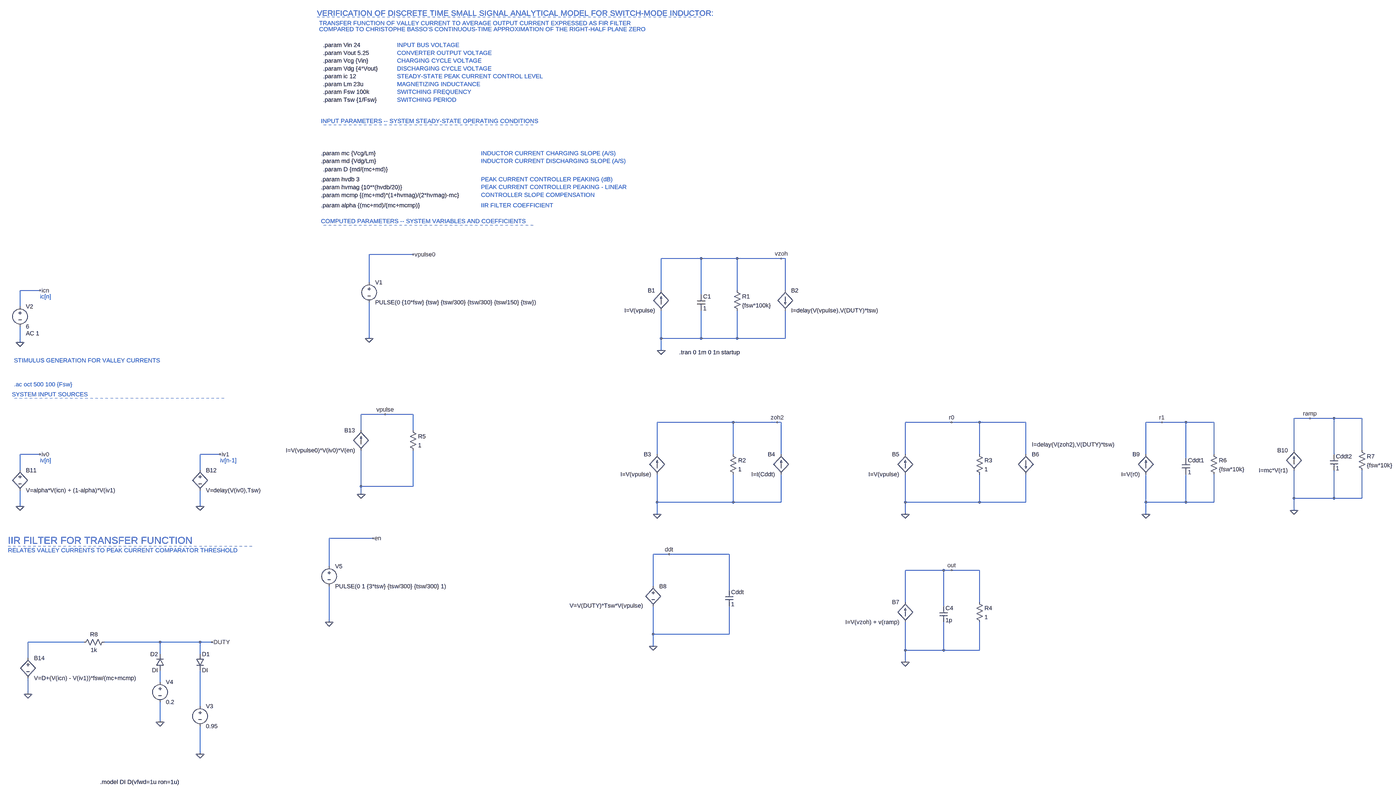
[diagram p0: schematic ZOH_time_domain.asc, whole sheet]
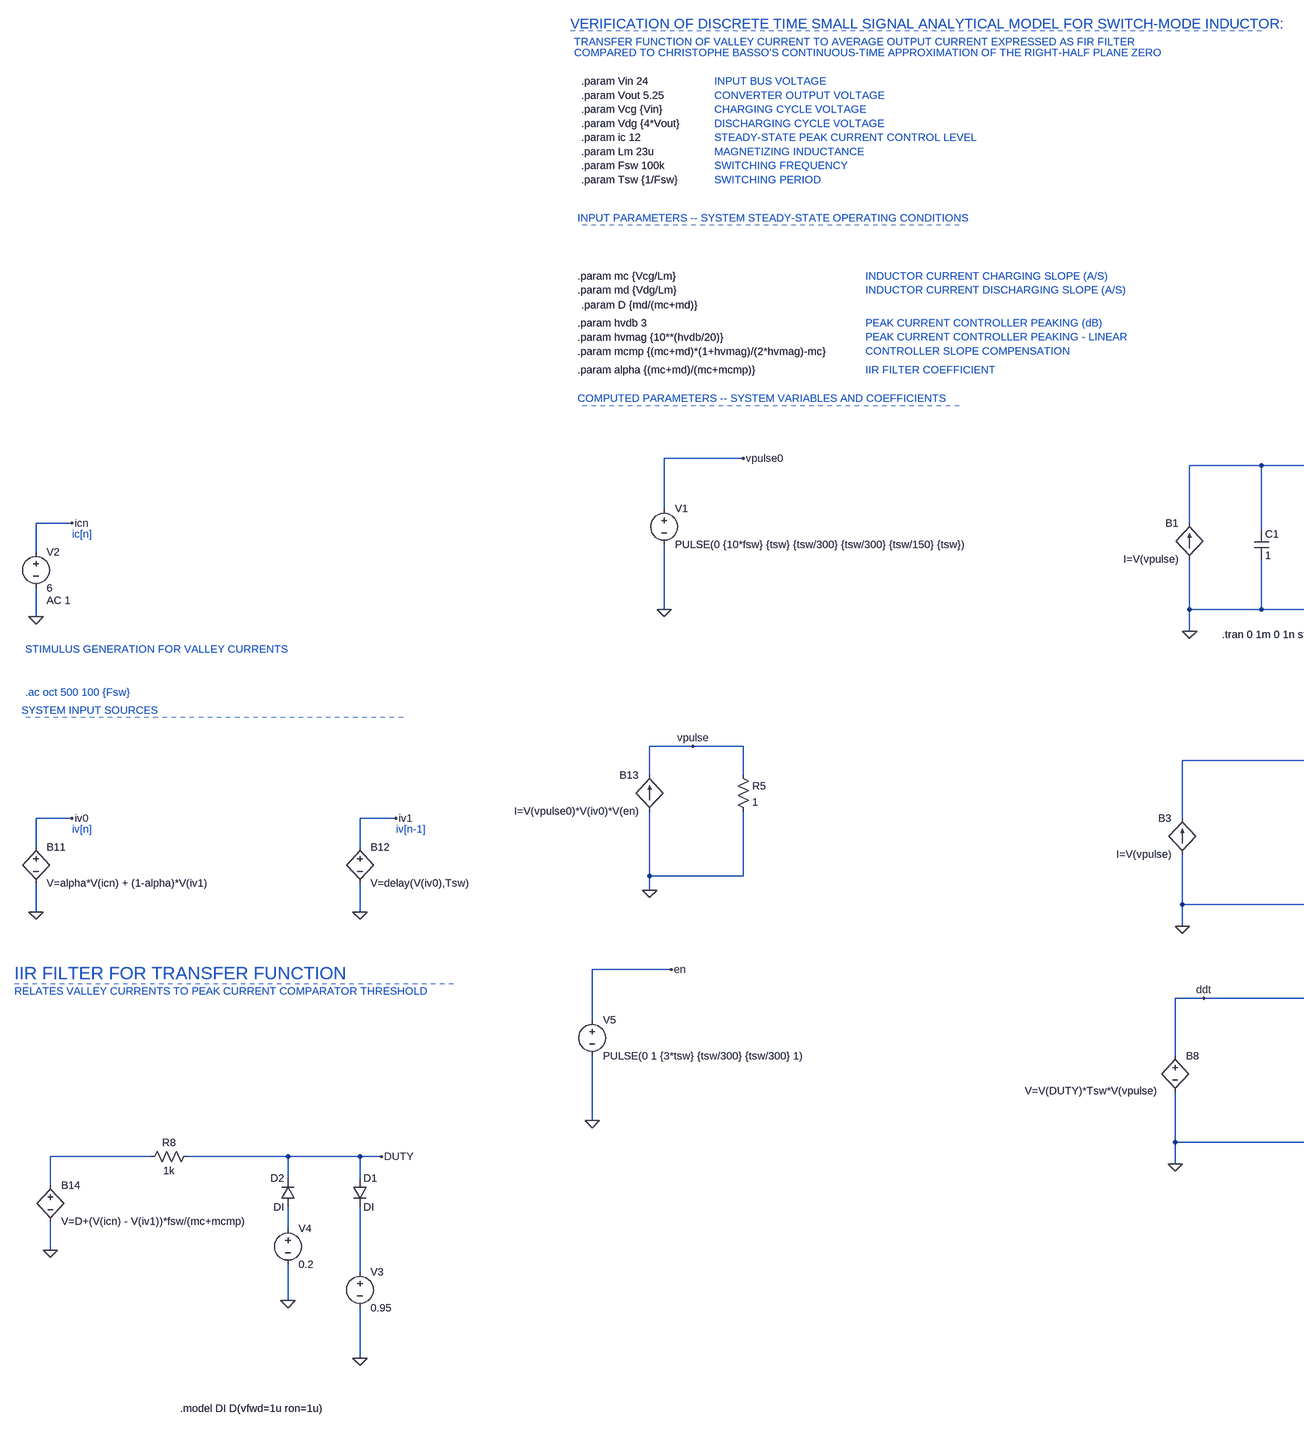
[diagram p1: schematic ZOH_time_domain.asc, part, row 1 of 1, column 1 of 2]
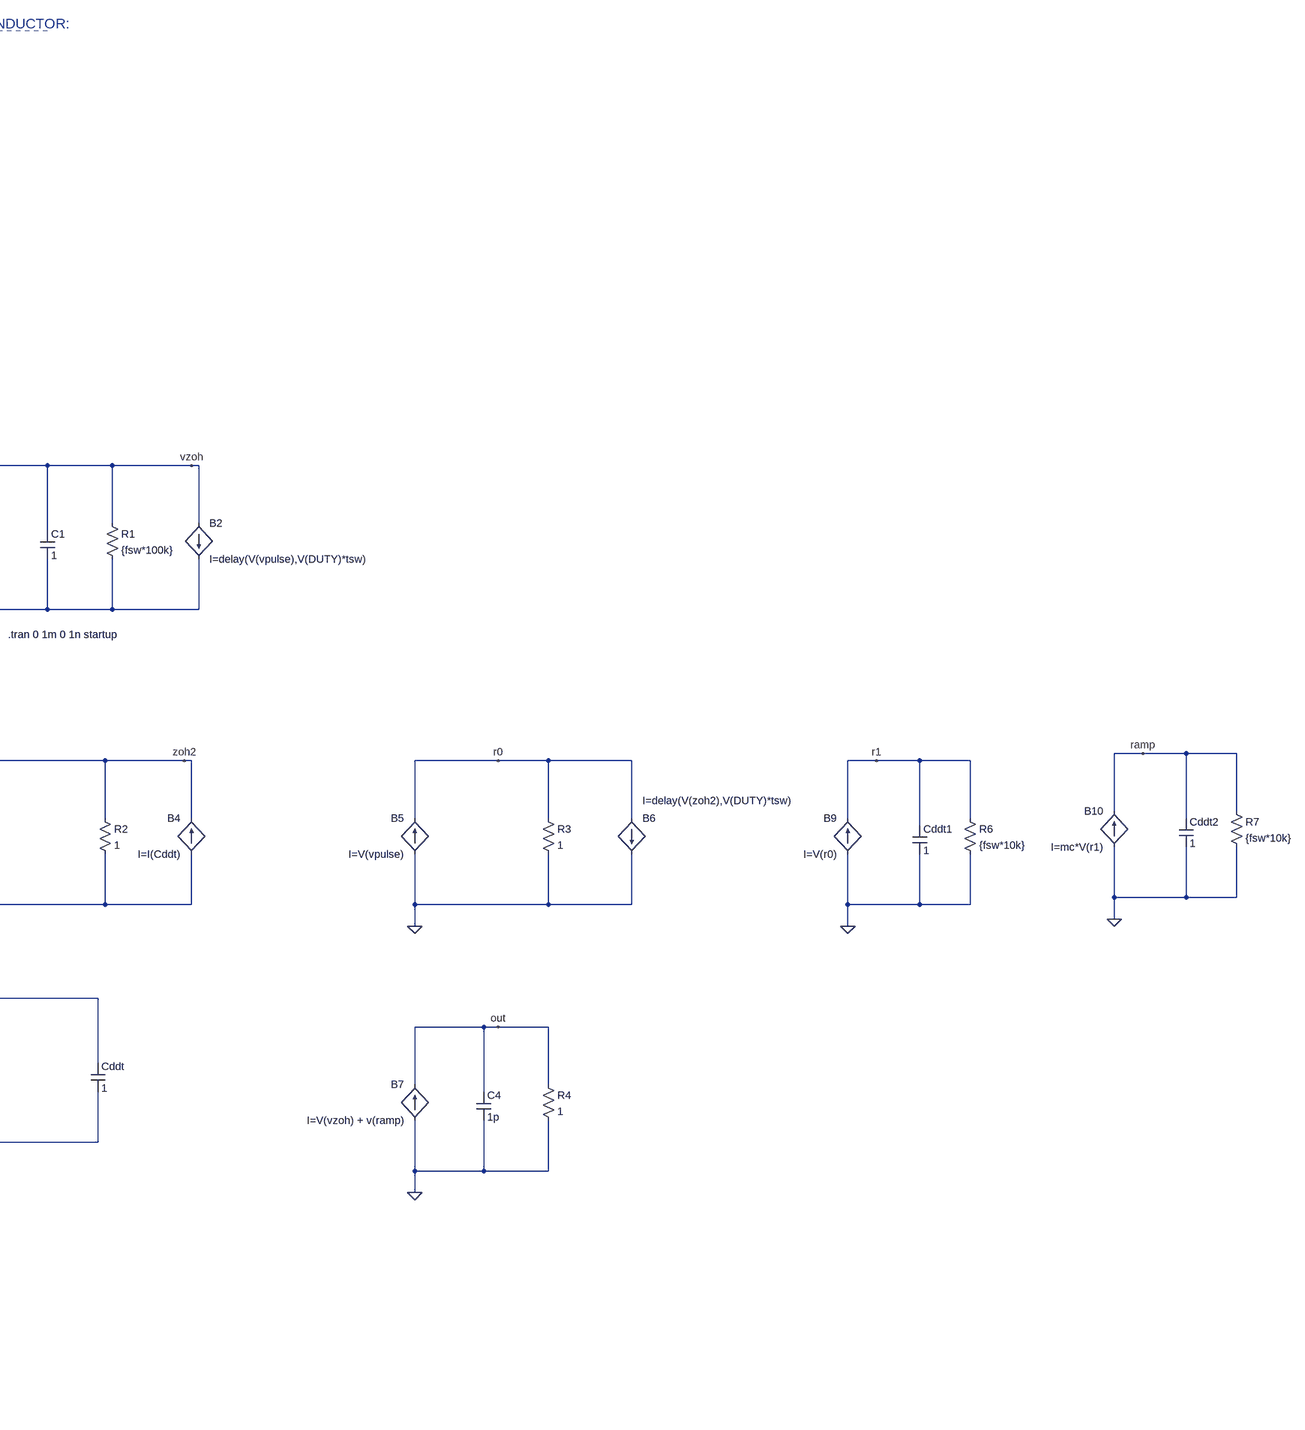
[diagram p2: schematic ZOH_time_domain.asc, part, row 1 of 1, column 2 of 2]
ZOH_time_domain.asc, the LTspice schematic file:
Version 4
SHEET 1 4228 4212
WIRE -848 208 -1024 208
WIRE 304 224 144 224
WIRE 448 224 304 224
WIRE 624 224 448 224
WIRE 640 224 624 224
WIRE -1024 320 -1024 208
WIRE -3120 352 -3200 352
WIRE 144 352 144 224
WIRE 448 352 448 224
WIRE 640 352 640 224
WIRE 304 368 304 224
WIRE -3200 416 -3200 352
WIRE -1024 544 -1024 400
WIRE 144 544 144 432
WIRE 304 544 304 432
WIRE 304 544 144 544
WIRE 448 544 448 432
WIRE 448 544 304 544
WIRE 640 544 640 432
WIRE 640 544 448 544
WIRE -3200 560 -3200 496
WIRE 144 592 144 544
WIRE -960 848 -1056 848
WIRE -848 848 -960 848
WIRE 2800 864 2736 864
WIRE 2896 864 2800 864
WIRE 3008 864 2896 864
WIRE 432 880 128 880
WIRE 608 880 432 880
WIRE 624 880 608 880
WIRE 1312 880 1120 880
WIRE 1424 880 1312 880
WIRE 1664 880 1424 880
WIRE 2208 880 2144 880
WIRE 2304 880 2208 880
WIRE 2416 880 2304 880
WIRE -1056 912 -1056 848
WIRE -848 912 -848 848
WIRE 2736 992 2736 864
WIRE 3008 992 3008 864
WIRE -3120 1008 -3200 1008
WIRE -2400 1008 -2480 1008
WIRE 128 1008 128 880
WIRE 432 1008 432 880
WIRE 624 1008 624 880
WIRE 1120 1008 1120 880
WIRE 1424 1008 1424 880
WIRE 1664 1008 1664 880
WIRE 2144 1008 2144 880
WIRE 2416 1008 2416 880
WIRE 2896 1008 2896 864
WIRE 2304 1024 2304 880
WIRE -3200 1072 -3200 1008
WIRE -2480 1072 -2480 1008
WIRE -1056 1136 -1056 992
WIRE -848 1136 -848 992
WIRE -848 1136 -1056 1136
WIRE -1056 1168 -1056 1136
WIRE 2736 1184 2736 1072
WIRE 2896 1184 2896 1072
WIRE 2896 1184 2736 1184
WIRE 3008 1184 3008 1072
WIRE 3008 1184 2896 1184
WIRE 128 1200 128 1088
WIRE 432 1200 432 1088
WIRE 432 1200 128 1200
WIRE 624 1200 624 1088
WIRE 624 1200 432 1200
WIRE 1120 1200 1120 1088
WIRE 1424 1200 1424 1088
WIRE 1424 1200 1120 1200
WIRE 1664 1200 1664 1088
WIRE 1664 1200 1424 1200
WIRE 2144 1200 2144 1088
WIRE 2304 1200 2304 1088
WIRE 2304 1200 2144 1200
WIRE 2416 1200 2416 1088
WIRE 2416 1200 2304 1200
WIRE -3200 1216 -3200 1152
WIRE -2480 1216 -2480 1152
WIRE 2736 1232 2736 1184
WIRE 128 1248 128 1200
WIRE 1120 1248 1120 1200
WIRE 2144 1248 2144 1200
WIRE -1008 1344 -1184 1344
WIRE 176 1408 112 1408
WIRE 416 1408 176 1408
WIRE -1184 1456 -1184 1344
WIRE 1280 1472 1120 1472
WIRE 1312 1472 1280 1472
WIRE 1424 1472 1312 1472
WIRE 112 1536 112 1408
WIRE 416 1552 416 1408
WIRE 1120 1600 1120 1472
WIRE 1424 1600 1424 1472
WIRE 1280 1616 1280 1472
WIRE -1184 1680 -1184 1536
WIRE 112 1728 112 1616
WIRE 416 1728 416 1616
WIRE 416 1728 112 1728
WIRE -2944 1760 -3168 1760
WIRE -2640 1760 -2864 1760
WIRE -2480 1760 -2640 1760
WIRE -2432 1760 -2480 1760
WIRE 112 1776 112 1728
WIRE 1120 1792 1120 1680
WIRE 1280 1792 1280 1680
WIRE 1280 1792 1120 1792
WIRE 1424 1792 1424 1680
WIRE 1424 1792 1280 1792
WIRE -2640 1808 -2640 1760
WIRE -2480 1808 -2480 1760
WIRE -3168 1824 -3168 1760
WIRE 1120 1840 1120 1792
WIRE -2640 1920 -2640 1872
WIRE -3168 1968 -3168 1904
WIRE -2480 2016 -2480 1872
WIRE -2640 2080 -2640 2000
WIRE -2480 2208 -2480 2096
FLAG -1024 544 0
FLAG -848 208 vpulse0
FLAG 144 592 0
FLAG 624 224 vzoh
FLAG 128 1248 0
FLAG 608 880 zoh2
FLAG 1120 1248 0
FLAG 1312 880 r0
FLAG 1120 1840 0
FLAG 1312 1472 out
FLAG 112 1776 0
FLAG 176 1408 ddt
FLAG 2144 1248 0
FLAG 2208 880 r1
FLAG 2736 1232 0
FLAG 2800 864 ramp
FLAG -3200 560 0
FLAG -3120 352 icn
FLAG -3200 1216 0
FLAG -3120 1008 iv0
FLAG -2480 1216 0
FLAG -2400 1008 iv1
FLAG -1056 1168 0
FLAG -960 848 vpulse
FLAG -3168 1968 0
FLAG -2432 1760 DUTY
FLAG -2640 2080 0
FLAG -2480 2208 0
FLAG -1184 1680 0
FLAG -1008 1344 en
SYMBOL voltage -1024 304 R0
WINDOW 123 0 0 Left 0
WINDOW 39 0 0 Left 0
SYMATTR InstName V1
SYMATTR Value PULSE(0 {10*fsw} {tsw} {tsw/300} {tsw/300} {tsw/150} {tsw})
SYMBOL bi 144 432 R180
WINDOW 0 24 80 Left 2
WINDOW 3 24 0 Left 2
SYMATTR InstName B1
SYMATTR Value I=V(vpulse)
SYMBOL res 432 336 R0
SYMATTR InstName R1
SYMATTR Value {fsw*100k}
SYMBOL bi 640 352 R0
SYMATTR InstName B2
SYMATTR Value I=delay(V(vpulse),V(DUTY)*tsw)
SYMBOL cap 288 368 R0
SYMATTR InstName C1
SYMATTR Value 1
SYMBOL bi 128 1088 R180
WINDOW 0 24 80 Left 2
WINDOW 3 24 0 Left 2
SYMATTR InstName B3
SYMATTR Value I=V(vpulse)
SYMBOL res 416 992 R0
SYMATTR InstName R2
SYMATTR Value 1
SYMBOL bi 624 1088 R180
WINDOW 0 24 80 Left 2
WINDOW 3 24 0 Left 2
SYMATTR InstName B4
SYMATTR Value I=I(Cddt)
SYMBOL bi 1120 1088 R180
WINDOW 0 24 80 Left 2
WINDOW 3 24 0 Left 2
SYMATTR InstName B5
SYMATTR Value I=V(vpulse)
SYMBOL res 1408 992 R0
SYMATTR InstName R3
SYMATTR Value 1
SYMBOL bi 1664 1008 R0
WINDOW 3 24 -39 Left 2
SYMATTR InstName B6
SYMATTR Value I=delay(V(zoh2),V(DUTY)*tsw)
SYMBOL bi 1120 1680 R180
WINDOW 0 24 80 Left 2
WINDOW 3 24 0 Left 2
SYMATTR InstName B7
SYMATTR Value I=V(vzoh) + v(ramp)
SYMBOL res 1408 1584 R0
SYMATTR InstName R4
SYMATTR Value 1
SYMBOL cap 1264 1616 R0
SYMATTR InstName C4
SYMATTR Value 1p
SYMBOL bi 2144 1088 R180
WINDOW 0 24 80 Left 2
WINDOW 3 24 0 Left 2
SYMATTR InstName B9
SYMATTR Value I=V(r0)
SYMBOL cap 2288 1024 R0
SYMATTR InstName Cddt1
SYMATTR Value 1
SYMBOL res 2400 992 R0
SYMATTR InstName R6
SYMATTR Value {fsw*10k}
SYMBOL bi 2736 1072 R180
WINDOW 0 24 80 Left 2
WINDOW 3 24 0 Left 2
SYMATTR InstName B10
SYMATTR Value I=mc*V(r1)
SYMBOL cap 2880 1008 R0
SYMATTR InstName Cddt2
SYMATTR Value 1
SYMBOL res 2992 976 R0
SYMATTR InstName R7
SYMATTR Value {fsw*10k}
SYMBOL cap 400 1552 R0
SYMATTR InstName Cddt
SYMATTR Value 1
SYMATTR SpiceLine Rser=100n
SYMBOL voltage -3200 400 R0
WINDOW 123 24 124 Left 2
WINDOW 39 0 0 Left 2
SYMATTR Value2 AC 1
SYMATTR InstName V2
SYMATTR Value 6
SYMBOL bv -3200 1056 R0
SYMATTR InstName B11
SYMATTR Value V=alpha*V(icn) + (1-alpha)*V(iv1)
SYMBOL bv -2480 1056 R0
SYMATTR InstName B12
SYMATTR Value V=delay(V(iv0),Tsw)
SYMBOL bi -1056 992 R180
WINDOW 0 24 80 Left 2
WINDOW 3 24 0 Left 2
SYMATTR InstName B13
SYMATTR Value I=V(vpulse0)*V(iv0)*V(en)
SYMBOL res -864 896 R0
SYMATTR InstName R5
SYMATTR Value 1
SYMBOL bv -3168 1808 R0
SYMATTR InstName B14
SYMATTR Value V=D+(V(icn) - V(iv1))*fsw/(mc+mcmp)
SYMBOL res -2848 1744 R90
WINDOW 0 0 56 VBottom 2
WINDOW 3 32 56 VTop 2
SYMATTR InstName R8
SYMATTR Value 1k
SYMBOL diode -2496 1808 R0
SYMATTR InstName D1
SYMATTR Value DI
SYMBOL diode -2624 1872 R180
WINDOW 0 24 64 Left 2
WINDOW 3 24 0 Left 2
SYMATTR InstName D2
SYMATTR Value DI
SYMBOL voltage -2480 2000 R0
WINDOW 123 0 0 Left 0
WINDOW 39 0 0 Left 0
SYMATTR InstName V3
SYMATTR Value 0.95
SYMBOL voltage -2640 1904 R0
WINDOW 123 0 0 Left 0
WINDOW 39 0 0 Left 0
SYMATTR InstName V4
SYMATTR Value 0.2
SYMBOL voltage -1184 1440 R0
WINDOW 123 0 0 Left 0
WINDOW 39 0 0 Left 0
SYMATTR InstName V5
SYMATTR Value PULSE(0 1 {3*tsw} {tsw/300} {tsw/300} 1)
SYMBOL bv 112 1520 R0
WINDOW 3 -334 94 Left 2
SYMATTR InstName B8
SYMATTR Value V=V(DUTY)*Tsw*V(vpulse)
TEXT -1208 -720 Left 2 !.param Vin 24\n.param Vout 5.25\n.param Vcg {Vin}\n.param Vdg {4*Vout}\n.param ic 12\n.param Lm 23u\n.param Fsw 100k\n.param Tsw {1/Fsw}
TEXT -1216 -272 Left 2 !.param mc {Vcg/Lm}\n.param md {Vdg/Lm}
TEXT -912 -720 Left 2 ;INPUT BUS VOLTAGE\nCONVERTER OUTPUT VOLTAGE\nCHARGING CYCLE VOLTAGE\nDISCHARGING CYCLE VOLTAGE\nSTEADY-STATE PEAK CURRENT CONTROL LEVEL\nMAGNETIZING INDUCTANCE\nSWITCHING FREQUENCY\nSWITCHING PERIOD
TEXT -1216 -416 Left 2 ;INPUT PARAMETERS -- SYSTEM STEADY-STATE OPERATING CONDITIONS
TEXT -576 -272 Left 2 ;INDUCTOR CURRENT CHARGING SLOPE (A/S)\nINDUCTOR CURRENT DISCHARGING SLOPE (A/S)
TEXT -1216 0 Left 2 ;COMPUTED PARAMETERS -- SYSTEM VARIABLES AND COEFFICIENTS
TEXT -1232 -848 Left 3 ;VERIFICATION OF DISCRETE TIME SMALL SIGNAL ANALYTICAL MODEL FOR SWITCH-MODE INDUCTOR:
TEXT -1224 -808 Left 2 ;TRANSFER FUNCTION OF VALLEY CURRENT TO AVERAGE OUTPUT CURRENT EXPRESSED AS FIR FILTER
TEXT -1224 -784 Left 2 ;COMPARED TO CHRISTOPHE BASSO'S CONTINUOUS-TIME APPROXIMATION OF THE RIGHT-HALF PLANE ZERO
TEXT -1216 -168 Left 2 !.param hvdb 3
TEXT -1216 -136 Left 2 !.param hvmag {10**(hvdb/20)}\n.param mcmp {(mc+md)*(1+hvmag)/(2*hvmag)-mc}
TEXT -576 -168 Left 2 ;PEAK CURRENT CONTROLLER PEAKING (dB)\nPEAK CURRENT CONTROLLER PEAKING - LINEAR\nCONTROLLER SLOPE COMPENSATION
TEXT -1216 -64 Left 2 !.param alpha {(mc+md)/(mc+mcmp)}
TEXT -576 -64 Left 2 ;IIR FILTER COEFFICIENT
TEXT 216 600 Left 2 !.tran 0 1m 0 1n startup
TEXT -1208 -208 Left 2 !.param D {md/(mc+md)}
TEXT -3224 728 Left 2 ;.ac oct 500 100 {Fsw}
TEXT -3120 376 Left 2 ;ic[n]
TEXT -3120 1032 Left 2 ;iv[n]
TEXT -3232 768 Left 2 ;SYSTEM INPUT SOURCES
TEXT -3224 632 Left 2 ;STIMULUS GENERATION FOR VALLEY CURRENTS
TEXT -3248 1352 Left 4 ;IIR FILTER FOR TRANSFER FUNCTION
TEXT -3248 1392 Left 2 ;RELATES VALLEY CURRENTS TO PEAK CURRENT COMPARATOR THRESHOLD
TEXT -2400 1032 Left 2 ;iv[n-1]
TEXT -2880 2320 Left 2 !.model DI D(vfwd=1u ron=1u)
LINE Normal -368 -400 -1216 -400 2
LINE Normal -368 16 -1216 16 2
LINE Normal 304 -832 -1232 -832 2
LINE Normal -2384 784 -3232 784 2
LINE Normal -2272 1376 -3248 1376 2

The netlist it stands for:
* ZOH_time_domain.asc
V1 vpulse0 0 PULSE(0 {10*fsw} {tsw} {tsw/300} {tsw/300} {tsw/150} {tsw})
B1 0 vzoh I=V(vpulse)
R1 vzoh 0 {fsw*100k}
B2 vzoh 0 I=delay(V(vpulse),V(DUTY)*tsw)
C1 vzoh 0 1
B3 0 zoh2 I=V(vpulse)
R2 zoh2 0 1
B4 0 zoh2 I=I(Cddt)
B5 0 r0 I=V(vpulse)
R3 r0 0 1
B6 r0 0 I=delay(V(zoh2),V(DUTY)*tsw)
B7 0 out I=V(vzoh) + v(ramp)
R4 out 0 1
C4 out 0 1p
B9 0 r1 I=V(r0)
Cddt1 r1 0 1
R6 r1 0 {fsw*10k}
B10 0 ramp I=mc*V(r1)
Cddt2 ramp 0 1
R7 ramp 0 {fsw*10k}
Cddt ddt 0 1 Rser=100n
V2 icn 0 6 AC 1
B11 iv0 0 V=alpha*V(icn) + (1-alpha)*V(iv1)
B12 iv1 0 V=delay(V(iv0),Tsw)
B13 0 vpulse I=V(vpulse0)*V(iv0)*V(en)
R5 vpulse 0 1
B14 N001 0 V=D+(V(icn) - V(iv1))*fsw/(mc+mcmp)
R8 DUTY N001 1k
D1 DUTY N003 DI
D2 N002 DUTY DI
V3 N003 0 0.95
V4 N002 0 0.2
V5 en 0 PULSE(0 1 {3*tsw} {tsw/300} {tsw/300} 1)
B8 ddt 0 V=V(DUTY)*Tsw*V(vpulse)
.model D D
.lib standard.dio
.param Vin 24
.param Vout 5.25
.param Vcg {Vin}
.param Vdg {4*Vout}
.param ic 12
.param Lm 23u
.param Fsw 100k
.param Tsw {1/Fsw}
.param mc {Vcg/Lm}
.param md {Vdg/Lm}
* INPUT BUS VOLTAGE
* CONVERTER OUTPUT VOLTAGE
* CHARGING CYCLE VOLTAGE
* DISCHARGING CYCLE VOLTAGE
* STEADY-STATE PEAK CURRENT CONTROL LEVEL
* MAGNETIZING INDUCTANCE
* SWITCHING FREQUENCY
* SWITCHING PERIOD
* INPUT PARAMETERS -- SYSTEM STEADY-STATE OPERATING CONDITIONS
* INDUCTOR CURRENT CHARGING SLOPE (A/S)
* INDUCTOR CURRENT DISCHARGING SLOPE (A/S)
* COMPUTED PARAMETERS -- SYSTEM VARIABLES AND COEFFICIENTS
* VERIFICATION OF DISCRETE TIME SMALL SIGNAL ANALYTICAL MODEL FOR SWITCH-MODE INDUCTOR:
* TRANSFER FUNCTION OF VALLEY CURRENT TO AVERAGE OUTPUT CURRENT EXPRESSED AS FIR FILTER
* COMPARED TO CHRISTOPHE BASSO'S CONTINUOUS-TIME APPROXIMATION OF THE RIGHT-HALF PLANE ZERO
.param hvdb 3
.param hvmag {10**(hvdb/20)}
.param mcmp {(mc+md)*(1+hvmag)/(2*hvmag)-mc}
* PEAK CURRENT CONTROLLER PEAKING (dB)
* PEAK CURRENT CONTROLLER PEAKING - LINEAR
* CONTROLLER SLOPE COMPENSATION
.param alpha {(mc+md)/(mc+mcmp)}
* IIR FILTER COEFFICIENT
.tran 0 1m 0 1n startup
.param D {md/(mc+md)}
* .ac oct 500 100 {Fsw}
* ic[n]
* iv[n]
* SYSTEM INPUT SOURCES
* STIMULUS GENERATION FOR VALLEY CURRENTS
* IIR FILTER FOR TRANSFER FUNCTION
* RELATES VALLEY CURRENTS TO PEAK CURRENT COMPARATOR THRESHOLD
* iv[n-1]
.model DI D(vfwd=1u ron=1u)
.backanno
.end